# EAGLE design PGTN002 (EAGLE 7.2.0)
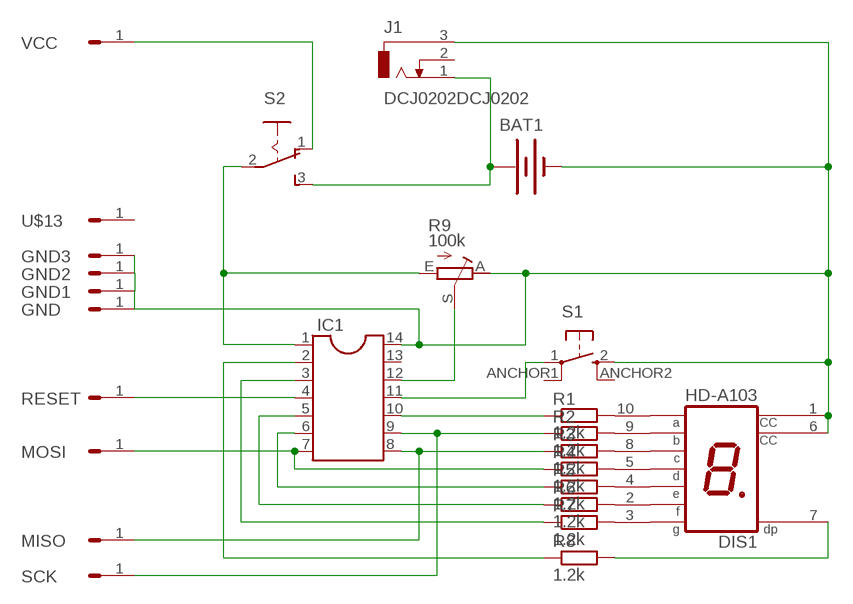
[diagram p0: schematic, sheet 1]

## Parts
BAT1  BATTERY20PTH  [BATTCOM_20MM_PTH]
DIS1  HD-A103  [HDSP-A]
GND  HEADER/MALE/01  [HEADER/MALE/01]
GND1  HEADER/MALE/01  [HEADER/MALE/01]
GND2  HEADER/MALE/01  [HEADER/MALE/01]
GND3  HEADER/MALE/01  [HEADER/MALE/01]
IC1  DIL14S  [SOCKET-14]
J1  DCJ0202DCJ0202  [DCJ0202]
MISO  HEADER/MALE/01  [HEADER/MALE/01]
MOSI  HEADER/MALE/01  [HEADER/MALE/01]
R1  1.2k  RESISTORRESISTOR/UPRIGHT/7.5  [RESISTOR/7.5]
R2  1.2k  RESISTORRESISTOR/UPRIGHT/7.5  [RESISTOR/7.5]
R3  1.2k  RESISTORRESISTOR/UPRIGHT/7.5  [RESISTOR/7.5]
R4  1.2k  RESISTORRESISTOR/UPRIGHT/7.5  [RESISTOR/7.5]
R5  1.2k  RESISTORRESISTOR/UPRIGHT/7.5  [RESISTOR/7.5]
R6  1.2k  RESISTORRESISTOR/UPRIGHT/7.5  [RESISTOR/7.5]
R7  1.2k  RESISTORRESISTOR/UPRIGHT/7.5  [RESISTOR/7.5]
R8  1.2k  RESISTORRESISTOR/UPRIGHT/7.5  [RESISTOR/7.5]
R9  100k  TRIMMERPT15  [TRIMMER/LI15]
RESET  HEADER/MALE/01  [HEADER/MALE/01]
S1  SWITCH_TACTILE  [TACTILE-PTH-SIDEEZ]
S2  SWITCH_SLIDE  [SWITCH_SLIDE]
SCK  HEADER/MALE/01  [HEADER/MALE/01]
U$13  HEADER/MALE/01  [HEADER/MALE/01]
VCC  HEADER/MALE/01  [HEADER/MALE/01]

## Nets
GND: BAT1.2(-) DIS1.1(CC) DIS1.6(CC) GND1.1 GND2.1 GND3.1 GND.1 IC1.14 J1.3 R9.A S1.2
N$1: DIS1.10(A) R1.2
N$2: DIS1.9(B) R2.2
N$3: DIS1.8(C) R3.2
N$4: DIS1.5(D) R4.2
N$5: DIS1.4(E) R5.2
N$6: DIS1.2(F) R6.2
N$7: DIS1.3(G) R7.2
N$8: DIS1.7(DP) R8.2
N$9: IC1.10 R1.1
N$10: IC1.8 MISO.1 R3.1
N$11: IC1.9 R2.1 SCK.1
N$12: IC1.7 MOSI.1 R4.1
N$13: IC1.6 R5.1
N$14: IC1.5 R6.1
N$15: IC1.3 R7.1
N$16: IC1.2 R8.1
N$17: IC1.11 S1.1
N$18: IC1.12 R9.S
N$19: IC1.1 R9.E S2.2(P)
N$20: BAT1.1(+) J1.1 S2.3(S)
N$21: IC1.4 RESET.1
N$22: S2.1(O) VCC.1
Unconnected: IC1.13 J1.2 S1.ANCHOR1 S1.ANCHOR2 U$13.1

## Library data of the parts
BAT1 = supply:BATTERY: Battery Holders Various common sizes : AA, AAA, 20mm coin cell and 12mm coin cell. 20MM_4LEGS, BATT-10373
DIS1 = display_led:HD-A103: LED DISPLAY 1-character 7 segment, decimal point right; OC_FARNELL: unknown; OC_NEWARK: unknown
GND GND1-GND3 MISO MOSI RESET SCK U$13 VCC = connectors:HEADER/MALE/01
IC1 = ic_package:DIL14: Dual In Line / Socket
J1 = connectors:DCJ0202: DC POWER JACK Source: DCJ0202.pdf; OC_FARNELL: unknown; OC_NEWARK: unknown
R1-R8 = resistors:RESISTOR: RESISTOR, European symbol
R9 = resistors:TRIMMER: Trimm resistor
S1 = electromechanical:SWITCH_TACTILE: Momentary Switch Button commonly used for reset or general input. Spark Fun Electronics SKU : COM-00097 SMT- SWCH-08247
S2 = electromechanical:SWITCH_SLIDE: SLIDING SWITCH Distributor Buerklin, 11G810

## Board
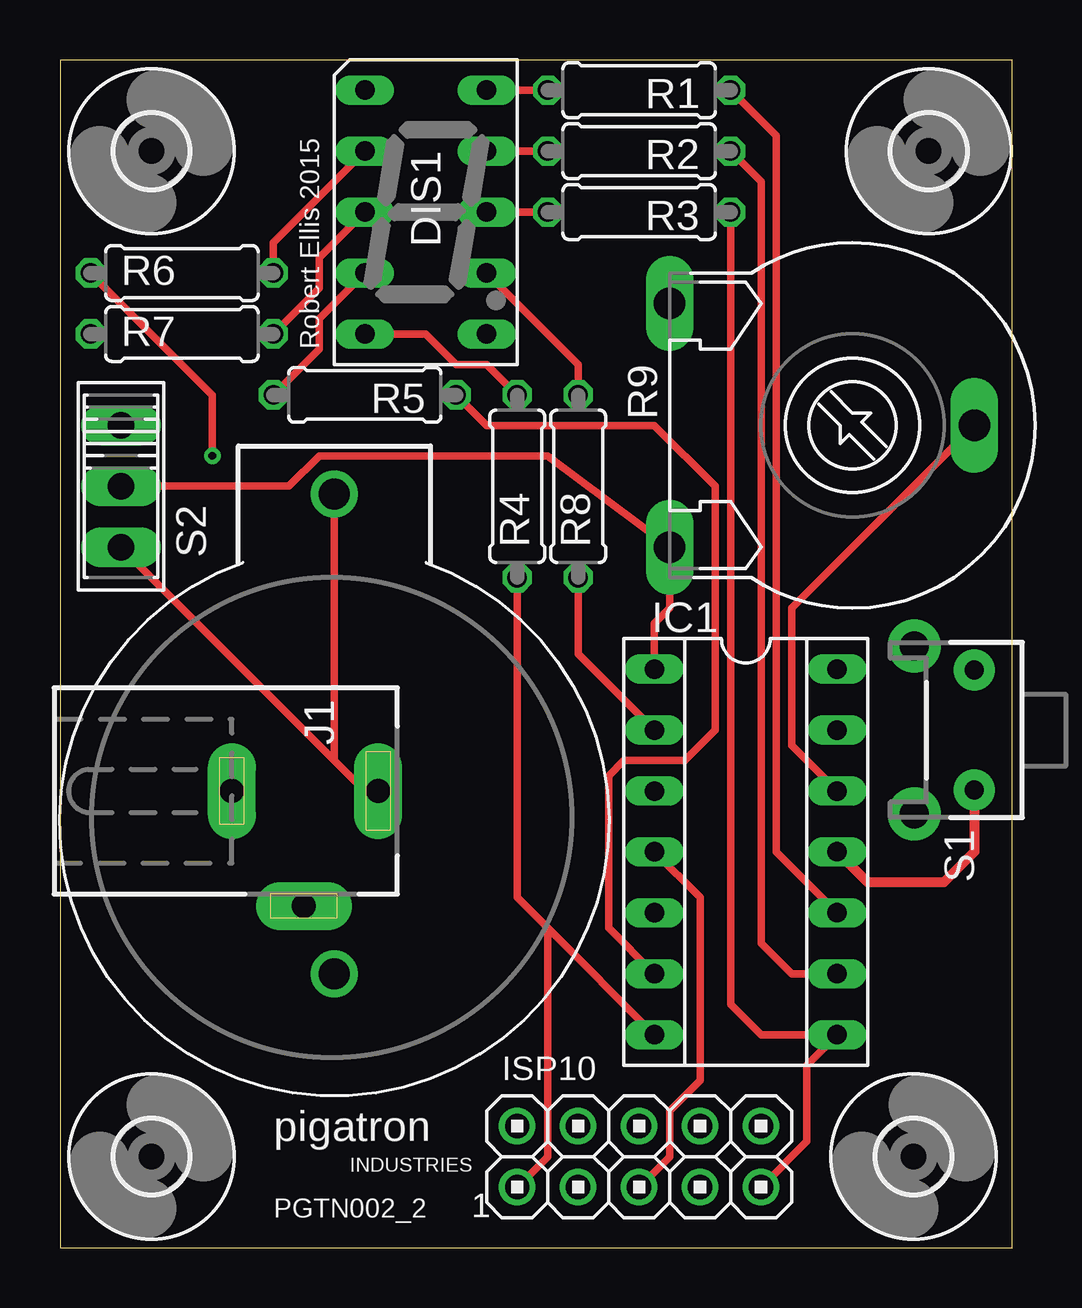
[diagram p1: board, top side]
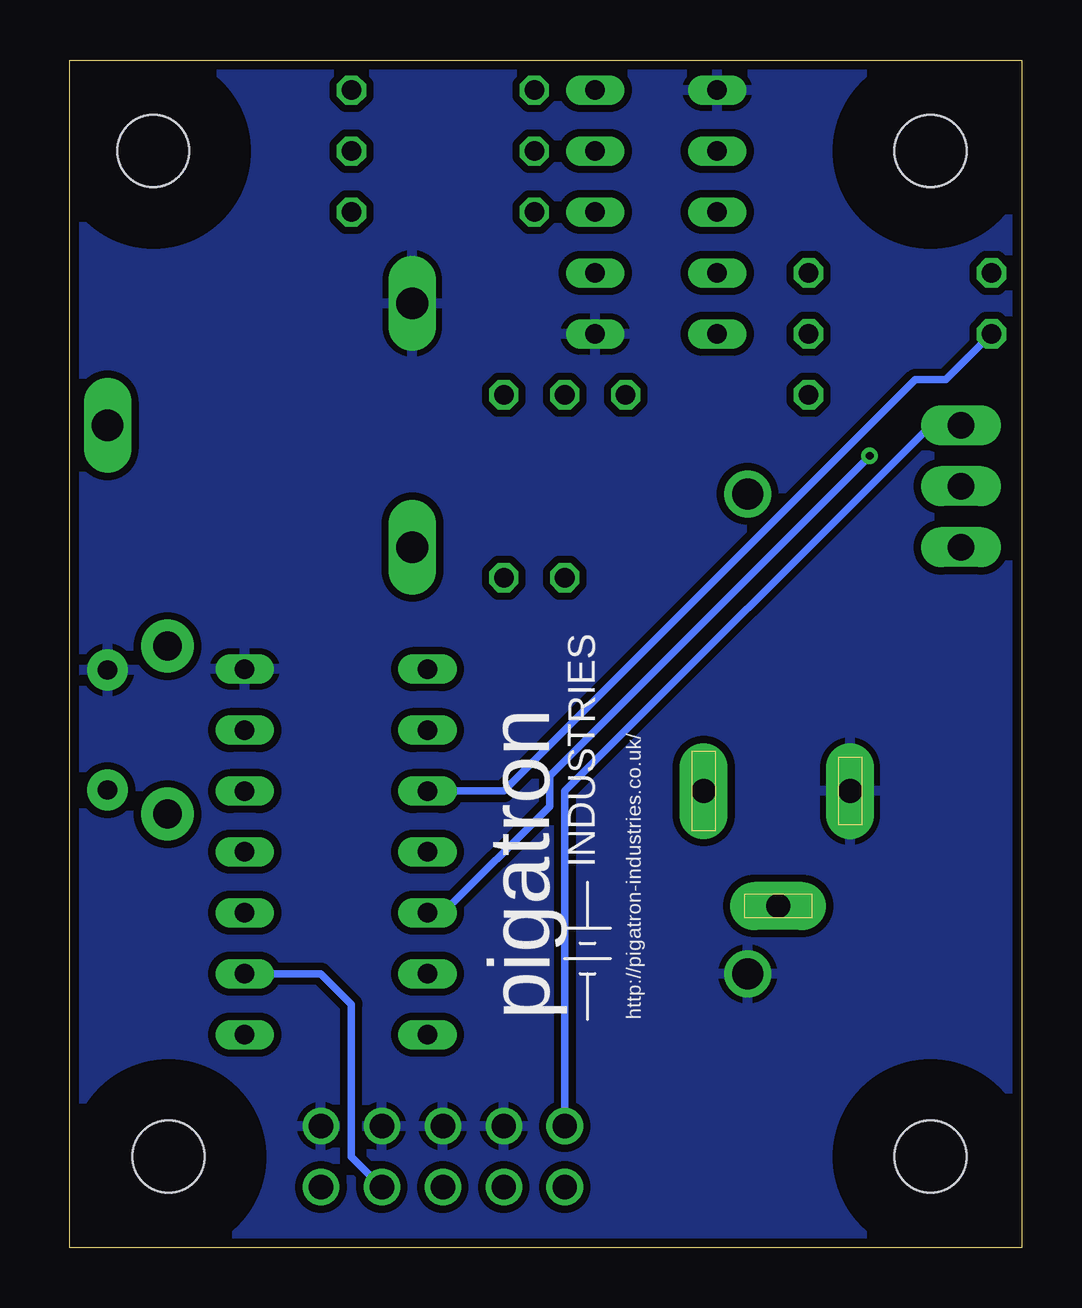
[diagram p2: board, bottom side, seen from below]

Size 39.67 x 49.52 mm. Coordinates in mm from the lower left corner, seen from the top.
Outline: 0,0 39.67,0 39.67,49.52 0,49.52 0,0
Copper layers (1*16): Top 0.0356mm / dielectric 1.5011mm / Bottom 0.0356mm
Design rules "oshpark *": minimum track width 12mil, minimum drill 13mil, track to track 12mil, track to pad 12mil, pad to pad 12mil, via to via 12mil, smd to smd 6mil, copper to edge 15mil, drill to drill 10mil, minimum pad ring 7mil, minimum via ring 7mil, stop-mask expansion 4mil, vias tented up to drill 0mil, thermal gap 10mil

### Footprints (pad centres in the part's own frame; a part is rotated, then mirrored left to right if it is on the bottom)
BATTCOM_20MM_PTH = drill 1.3: 1 20,0; 2 0,0
HDSP-A = drill 0.813 long: 1 -2.54,5.08; 2 -2.54,2.54; 3 -2.54,0; 4 -2.54,-2.54; 5 -2.54,-5.08; 6 2.54,-5.08; 7 2.54,-2.54; 8 2.54,0; 9 2.54,2.54; 10 2.54,5.08
HEADER/MALE/01 = drill 1.016: 1 0,0
SOCKET-14 = drill 0.813 long: 1 -7.62,-3.81; 2 -5.08,-3.81; 3 -2.54,-3.81; 4 0,-3.81; 5 2.54,-3.81; 6 5.08,-3.81; 7 7.62,-3.81; 8 7.62,3.81; 9 5.08,3.81; 10 2.54,3.81; 11 0,3.81; 12 -2.54,3.81; 13 -5.08,3.81; 14 -7.62,3.81
DCJ0202 = drill 1 pad 2 long: 1 0,3.1; 2 4.8,0; 3 0,-3
RESISTOR/7.5 = drill 0.813 octagon: 1 -3.81,0; 2 3.81,0
TRIMMER/LI15 = drill 1.321 long: A -5.08,-7.62; E 5.08,-7.62; S 0,5.08
TACTILE-PTH-SIDEEZ = drill 0.8 pad 1.7: 1 -2.5,0; 2 2.5,0 | drill 1.2 pad 2.2: ANCHOR1 -3.5,2.5; ANCHOR2 3.5,2.5
SWITCH_SLIDE = drill 1.118 long: 1 -2.54,0; 2 0,0; 3 2.54,0
STANDOFF/3.0 = hole 3: 0,0

### Placement (x,y rotation side)
BAT1  11.43,11.43 90 top
DIS1  15.24,43.18 0 top
GND  21.59,5.08 90 top
GND1  24.13,5.08 0 top
GND2  26.67,5.08 0 top
GND3  29.21,5.08 0 top
IC1  28.57,16.51 270 top
J1  10.16,19.05 270 top
MISO  29.21,2.54 270 top
MOSI  19.05,2.54 270 top
R1  24.13,48.26 180 top
R2  24.13,45.72 180 top
R3  24.13,43.18 180 top
R4  19.05,31.75 90 top
R5  12.7,35.56 180 top
R6  5.08,40.64 0 top
R7  5.08,38.1 0 top
R8  21.59,31.75 90 top
R9  33.02,34.29 270 top
RESET  24.13,2.54 90 top
S1  38.1,21.59 90 top
S2  2.54,31.75 270 top
SCK  26.67,2.54 270 top
U$1  [STANDOFF/3.0]  3.81,3.81 0 top
U$2  [STANDOFF/3.0]  36.19,45.72 0 top
U$3  [STANDOFF/3.0]  35.56,3.81 0 top
U$4  [STANDOFF/3.0]  3.81,45.72 0 top
U$11  [PIGATRON-LOGO]  19.68,18.41 90 bottom
U$12  [PIGATRON-WEB]  15.87,17.14 90 bottom
U$13  21.59,2.54 180 top
VCC  19.05,5.08 90 top

### Tracks (layer width: path | path; a pad name or v marks a point on that pad's centre or on a via)
GND
  pour Bottom: 0,49.53 39.37,49.53 39.37,0 0,0
N$1
  Top 0.305: R1.2 DIS1.10
N$2
  Top 0.305: R2.2 DIS1.9
N$3
  Top 0.305: R3.2 DIS1.8
N$4
  Top 0.305: DIS1.5 15.24,38.1 16.51,36.83 17.78,36.83 R4.2
N$5
  Top 0.305: R5.2 10.79,37.47 10.79,38.73 DIS1.4
N$6
  Top 0.305: R6.2 8.89,41.91 DIS1.2
N$7
  Top 0.305: R7.2 10.79,40 10.79,41.28 DIS1.3
N$8
  Top 0.305: R8.2 21.59,36.83 DIS1.7
N$9
  Top 0.305: IC1.10 29.85,16.51 29.85,46.36 R1.1
N$10
  Top 0.305: MISO.1 31.11,4.45 31.11,7.62 IC1.8 29.21,8.89 27.94,10.16 R3.1
N$11
  Top 0.305: IC1.9 30.48,11.43 29.21,12.7 29.21,44.45 R2.1
  Bottom 0.305: SCK.1 27.94,3.81 27.94,10.16 29.21,11.43 IC1.9
N$12
  Top 0.305: 20.32,13.34 19.05,14.61 R4.1 | 20.32,13.34 IC1.7 | MOSI.1 20.32,3.81 20.32,13.34
N$13
  Top 0.305: IC1.6 22.86,13.34 22.86,19.68 23.5,20.32 26.04,20.32 27.3,21.59 27.3,31.75 24.76,34.29 17.78,34.29 R5.1
N$14  (via drill 0.33)
  Top 0.305: v6.35,33.02 6.35,35.56 R6.1
  Bottom 0.305: IC1.5 24.13,13.97 19.68,18.41 19.68,19.68 v6.35,33.02
N$15
  Bottom 0.305: R7.1 3.18,36.2 4.44,36.2 21.59,19.05 IC1.3
N$16
  Top 0.305: IC1.2 21.59,24.77 R8.1
N$17
  Top 0.406: S1.1 38.1,16.51 36.83,15.24 33.66,15.24 IC1.11
N$18
  Top 0.305: IC1.12 30.48,20.96 30.48,26.67 R9.S
N$19
  Top 0.305: S2.2 9.53,31.75 10.79,33.02 20.32,33.02 R9.E 25.4,26.67 24.76,26.04 IC1.1
N$20
  Top 0.305: 11.43,20.32 12.7,19.05 J1.1 | 11.43,20.32 S2.3 | 11.43,20.32 BAT1.1
N$21
  Top 0.305: IC1.4 26.67,14.61 26.67,6.98 25.4,5.71 25.4,3.81 RESET.1
N$22
  Bottom 0.305: VCC.1 19.05,19.05 3.81,34.29 S2.1

### Text on the board
tNames: Robert Ellis 2015 | ISP10 | pigatron | INDUSTRIES | PGTN002_2 | 1